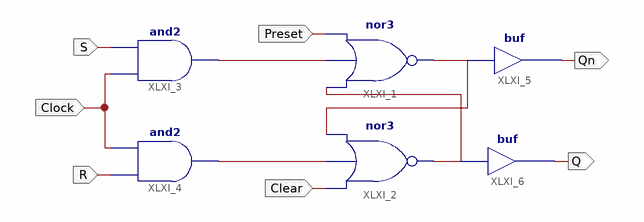
[diagram p0: schematic sheet 1]
// Xilinx ISE schematic latch_rs_enabled_preset.sch (spartan3e) as structural Verilog: 6 symbols, 7 ports
module latch_rs_enabled_preset (
  input  Clock,
  input  S,
  input  R,
  input  Clear,
  input  Preset,
  output Qn,
  output Q
);

  wire XLXN_2, XLXN_3, XLXN_4, XLXN_5;

  nor XLXI_1 (XLXN_4, XLXN_5, XLXN_2, Preset);
  nor XLXI_2 (XLXN_5, Clear, XLXN_3, XLXN_4);
  and XLXI_3 (XLXN_2, Clock, S);
  and XLXI_4 (XLXN_3, R, Clock);
  buf XLXI_5 (Qn, XLXN_4);
  buf XLXI_6 (Q, XLXN_5);
endmodule
